# EAGLE schematic Adafruit TXB0108 (EAGLE 7.7.0)
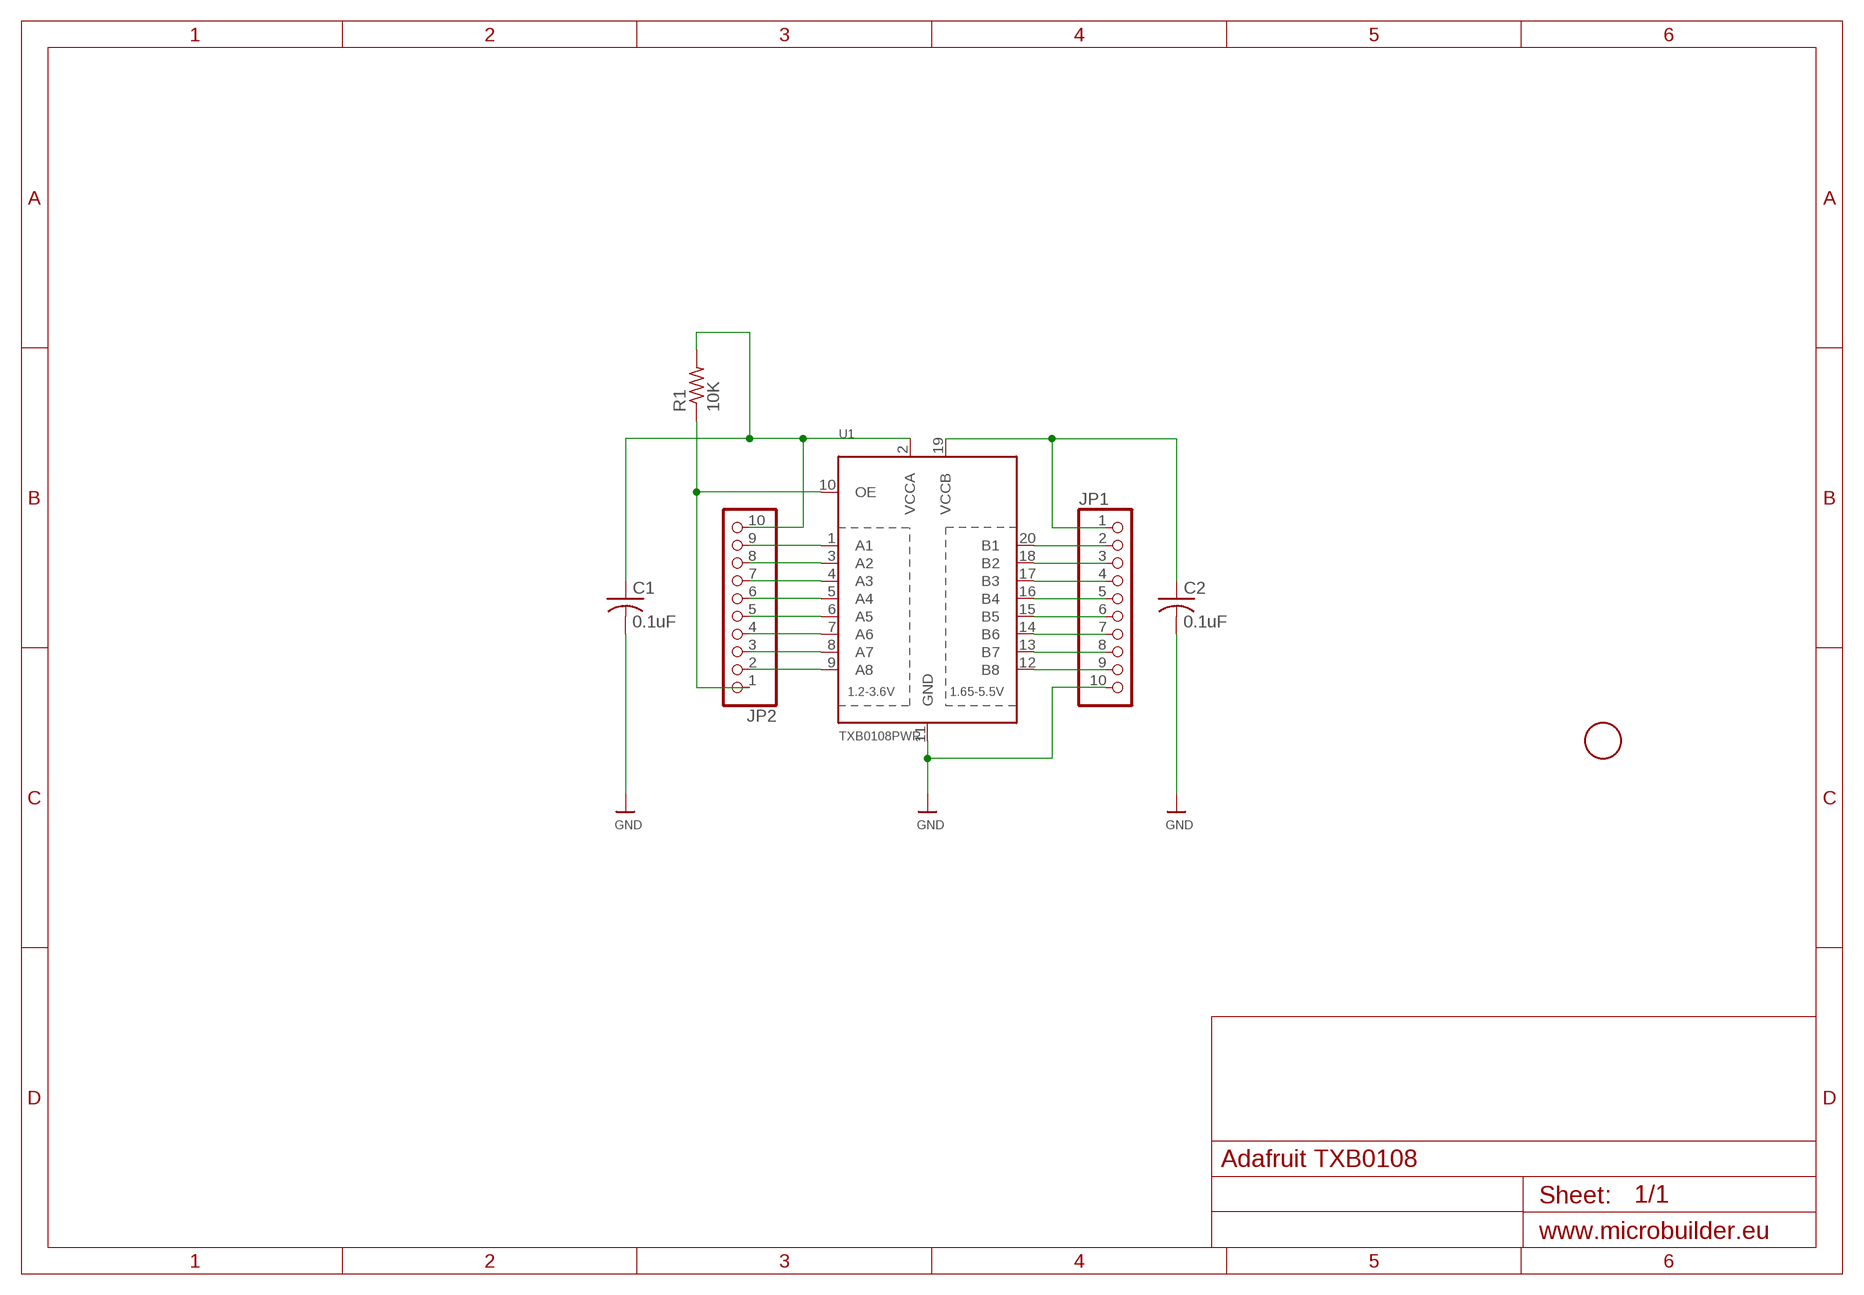
[diagram p0: schematic, sheet 1]

## Parts
C1  0.1uF  C-USC0805  [C0805]
C2  0.1uF  C-USC0805  [C0805]
JP1  HEADER-1X10THICKER  [1X10_ROUND_76]
JP2  HEADER-1X10THICKER  [1X10_ROUND_76]
R1  10K  R-US_R0805  [R0805]
U1  TXB0108PWR  [TSSOP20]
U$6  FIDUCIAL  [FIDUCIAL_1MM]

## Nets
GND: C1.2 C2.2 JP1.10 U1.11(GND)
N$2: JP1.9 U1.12(B8)
N$3: JP1.8 U1.13(B7)
N$4: JP1.7 U1.14(B6)
N$5: JP1.6 U1.15(B5)
N$6: JP1.5 U1.16(B4)
N$7: JP1.4 U1.17(B3)
N$8: JP1.3 U1.18(B2)
N$9: JP1.2 U1.20(B1)
N$10: C2.1 JP1.1 U1.19(VCCB)
N$11: C1.1 JP2.10 R1.2 U1.2(VCCA)
N$12: JP2.9 U1.1(A1)
N$13: JP2.8 U1.3(A2)
N$14: JP2.7 U1.4(A3)
N$15: JP2.6 U1.5(A4)
N$16: JP2.5 U1.6(A5)
N$17: JP2.4 U1.7(A6)
N$18: JP2.3 U1.8(A7)
N$19: JP2.2 U1.9(A8)
N$20: JP2.1 R1.1 U1.10(OE)

## Library data of the parts
C1 C2 = adafruit:C-US: CAPACITOR, American symbol
JP1 JP2 = microbuilder:HEADER-1X10: PIN HEADER
R1 = adafruit:R-US_: RESISTOR, American symbol
U1 = microbuilder:TXB0108PWR: 8-Bit Bi-Directional Level Shifter 1.2V-3.6V (VCCA) to 1.65V-5.5V (VCCB) bi-directional level shifter with auto direction sensing. Max data rate - VCCA 1.8V: 20Mbps (50ns), VCCA 3.3V: 100Mbps (10ns) Digikey: 296-21527-1-ND
U$6 = adafruit:FIDUCIAL: For use by pick and place machines to calibrate the vision/machine, 1mm By microbuilder.eu